# EAGLE design 0223-carrier-class-d-16W (EAGLE 9.6.2)
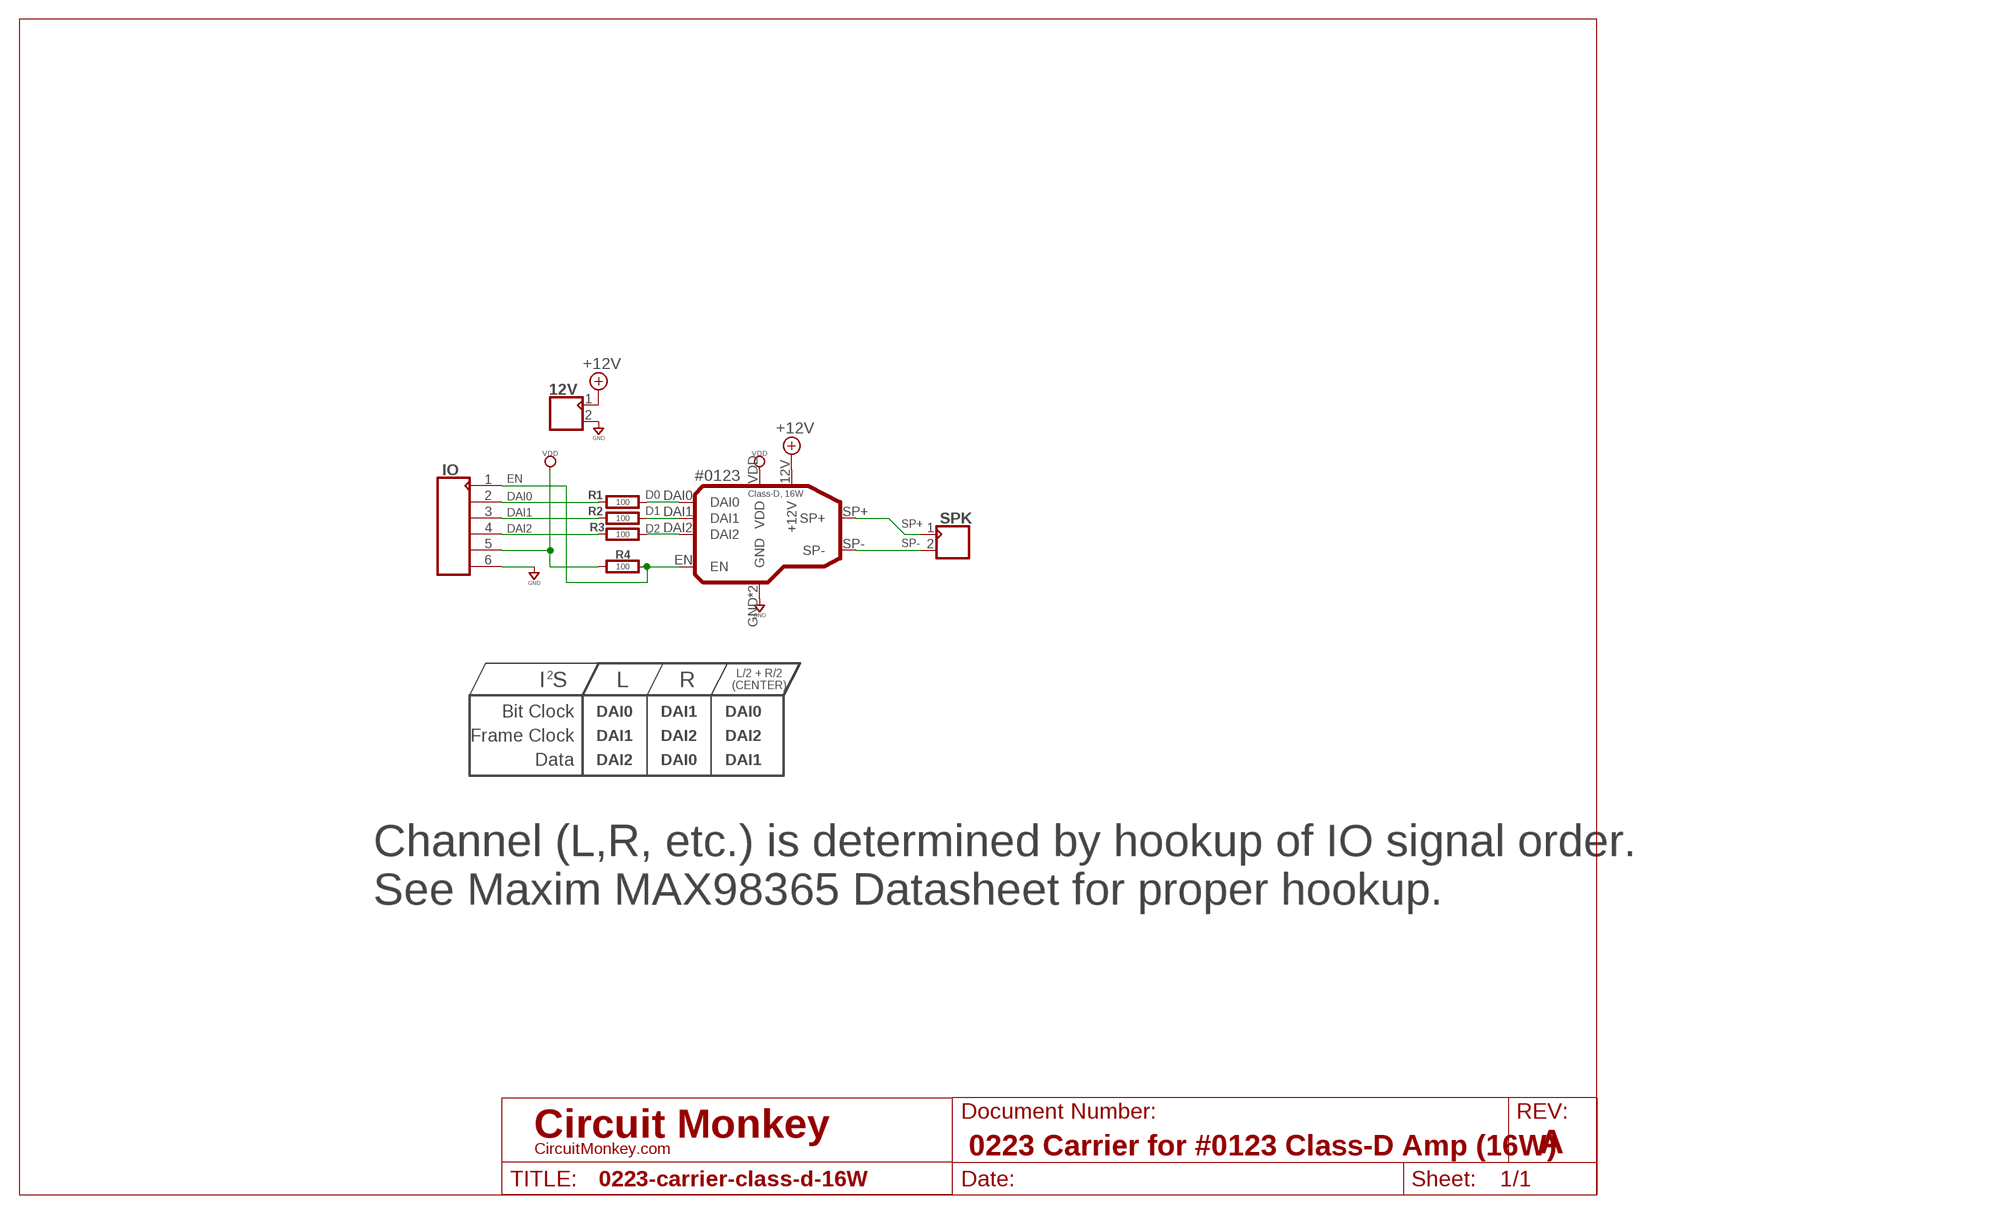
[diagram p0: schematic, sheet 1]
SHEET1 (LETTER_L-CIRCUITMONKEY): DOCUMENT_NUMBER: 0223 Carrier for #0123 Class-D Amp (16W); REV: A

## Parts
12V  CON_02X1-2.54MM-THD-VT  [MA02X1-VT-THD]
#0123  Class-D, 16W  0123REV-A  [0123A]
IO  CON_06X1-VT  [MA06X1-VT-THD]
R1  100  RESISTOR0603  [0603-RES]
R2  100  RESISTOR0603  [0603-RES]
R3  100  RESISTOR0603  [0603-RES]
R4  100  RESISTOR0603  [0603-RES]
SPK  CON_02X1-2.54MM-THD-VT  [MA02X1-VT-THD]

## Nets
+12V: 12V.1 #0123.12V(+12V)
D0: #0123.DAI0 R1.2
D1: #0123.DAI1 R2.2
D2: #0123.DAI2 R3.2
DAI0: IO.2 R1.1
DAI1: IO.3 R2.1
DAI2: IO.4 R3.1
EN: #0123.EN IO.1 R4.2
GND: 12V.2 #0123.GND #0123.GND2(GND) IO.6
SP+: #0123.SP+ SPK.1
SP-: #0123.SP- SPK.2
VDD: #0123.VDD IO.5 R4.1

## Notes on the sheet
- 2
- L/2 + R/2
  (CENTER)
- I | S | L | R
- Bit Clock | DAI0 | DAI1 | DAI0
- Frame Clock | DAI1 | DAI2 | DAI2
- Data | DAI2 | DAI0 | DAI1
- Channel (L,R, etc.) is determined by hookup of IO signal order. 
  See Maxim MAX98365 Datasheet for proper hookup.

## Library data of the parts
12V SPK = con-headers:CON_02X1: Connector, 2P
#0123 = circuit-monkey-chips:0123: Class-D Amplifier, 16W
IO = con-headers:CON_06X1: Header, 6-pin, single row; COST01: 0.30; COST10: 0.20; COST100: 0.10
R1-R4 = rlc:RESISTOR: Resistor; COST01: 0.10; COST10: 0.05; COST100: 0.02

## Board
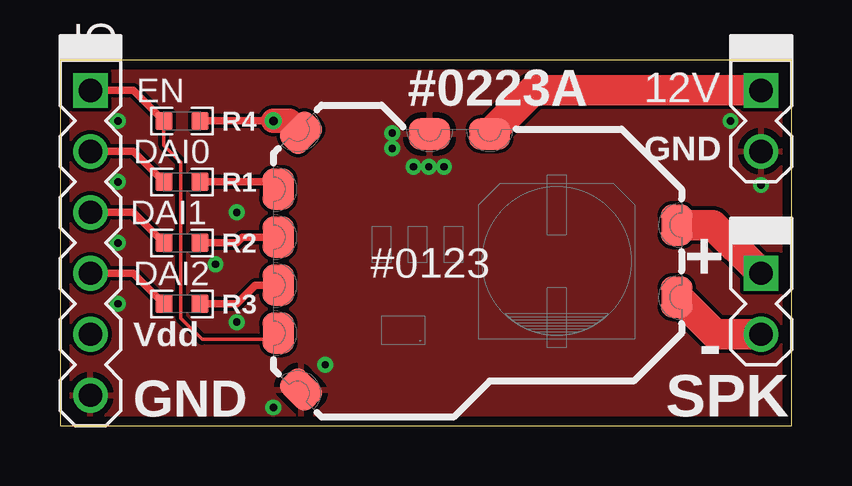
[diagram p1: board, top side]
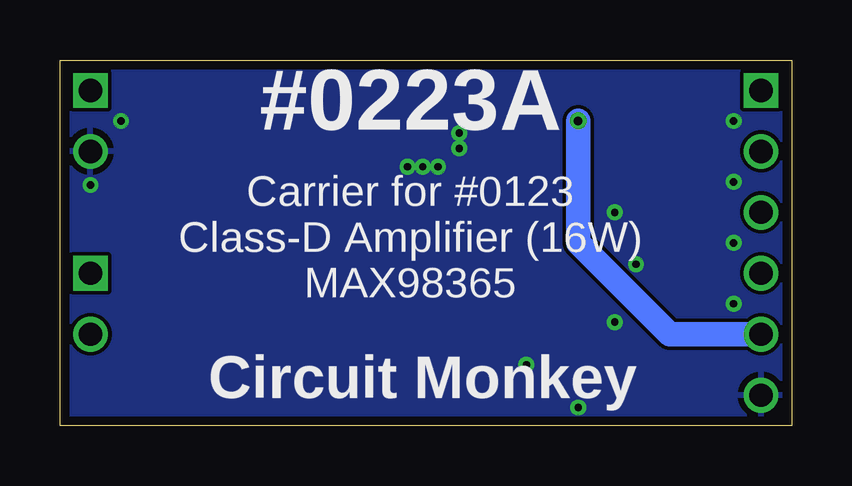
[diagram p2: board, bottom side, seen from below]

Size 30.48 x 15.24 mm. Coordinates in mm from the lower left corner, seen from the top.
Outline: 0,0 30.48,0 30.48,15.24 0,15.24 0,0
Copper layers (1*16): Top 0.0356mm / dielectric 1.5011mm / Bottom 0.0356mm
Design rules "OSH-CircuitMonkey": minimum track width 6mil, minimum drill 12mil, track to track 6mil, track to pad 6mil, pad to pad 6mil, via to via 6mil, smd to smd 6mil, copper to edge 15mil, drill to drill 6mil, minimum pad ring 7mil, minimum via ring 7mil, stop-mask expansion 3mil, vias tented up to drill 13mil, thermal gap 10mil

### Footprints (pad centres in the part's own frame; a part is rotated, then mirrored left to right if it is on the bottom)
MA02X1-VT-THD = drill 0.965 square: 1 -1.27,0 | drill 0.965: 2 1.27,0
0123A = smd 1.7 x 1.3: 12V 0.5,5.3; GND2 -2,5.3 | smd 1.3 x 1.7: DAI0 -8.3,3; DAI1 -8.3,1; DAI2 -8.3,-1; EN -8.3,-3; SP+ 8.3,1.5; SP- 8.3,-1.5 | smd 1.3 x 1.7 rotated 45: GND -7.35,-5.35 | smd 1.3 x 1.7 rotated 135: VDD -7.35,5.35
MA06X1-VT-THD = drill 0.965 square: 1 0,0 | drill 0.965: 2 2.54,0; 3 5.08,0; 4 7.62,0; 5 10.16,0; 6 12.7,0
0603-RES = smd 0.711 x 0.762: 1 -0.752,0; 2 0.752,0

### Placement (x,y rotation side)
12V  29.21,12.7 270 top
#0123  17.4,6.86 0 top
IO  1.27,13.97 270 top
R1  5.08,10.16 0 top
R2  5.08,7.62 0 top
R3  5.08,5.08 0 top
R4  5.08,12.7 180 top
SPK  29.21,5.08 270 top

### Tracks (layer width: path | path; a pad name or v marks a point on that pad's centre or on a via)
+12V
  Top 1.27: 12V.1 19.71,13.97 #0123.12V
D0
  Top 0.305: R1.2 8.8,10.16 #0123.DAI0
D1
  Top 0.305: R2.2 7.36,7.62 7.59,7.86 #0123.DAI1
D2
  Top 0.305: R3.2 7.36,5.08 8.13,5.86 #0123.DAI2
DAI0
  Top 0.305: IO.2 3.06,11.43 R1.1
DAI1
  Top 0.305: IO.3 3.06,8.89 R2.1
DAI2
  Top 0.305: IO.4 3.06,6.35 R3.1
EN
  Top 0.152: #0123.EN 8.85,3.6 5.92,3.6 5.04,4.49 5.04,10.97 4.33,11.69 R4.2
  Top 0.305: IO.1 3.06,13.97 R4.2
GND  (via drill 0.3)
  other vias: 2.41,12.7 2.41,10.16 2.41,7.62 2.41,5.08 11.05,2.54 8.89,0.76 15.37,10.79 13.84,12.19 16,10.79 14.73,10.79 29.21,10.03 27.94,12.7 13.84,11.56 7.37,8.89 6.48,6.73 7.37,4.32
  pour Top: 0,0 0,15.24 30.48,15.24 30.48,0
  pour Bottom: 30.48,0 30.48,15.24 0,15.24 0,0
SP+
  Top 1.27: SPK.1 27.2,8.36 #0123.SP+
SP-
  Top 1.27: #0123.SP- 25.76,5.36 27.3,3.81 SPK.2
VDD  (via drill 0.35)
  Top 0.305: v8.89,12.7 R4.1
  Top 1.016: v8.89,12.7 9.56,12.7 #0123.VDD
  Bottom 1.016: IO.5 5.08,3.81 8.89,7.62 v8.89,12.7

### Text on the board
tPlace: EN | #0223A | GND | DAI0 | DAI1 | + | DAI2 | Vdd | - | GND
bPlace: #0223A | Carrier for #0123 / Class-D Amplifier (16W) / MAX98365 | Circuit Monkey